# EAGLE design choochoo_v1_brd1 (EAGLE 7.7.0)
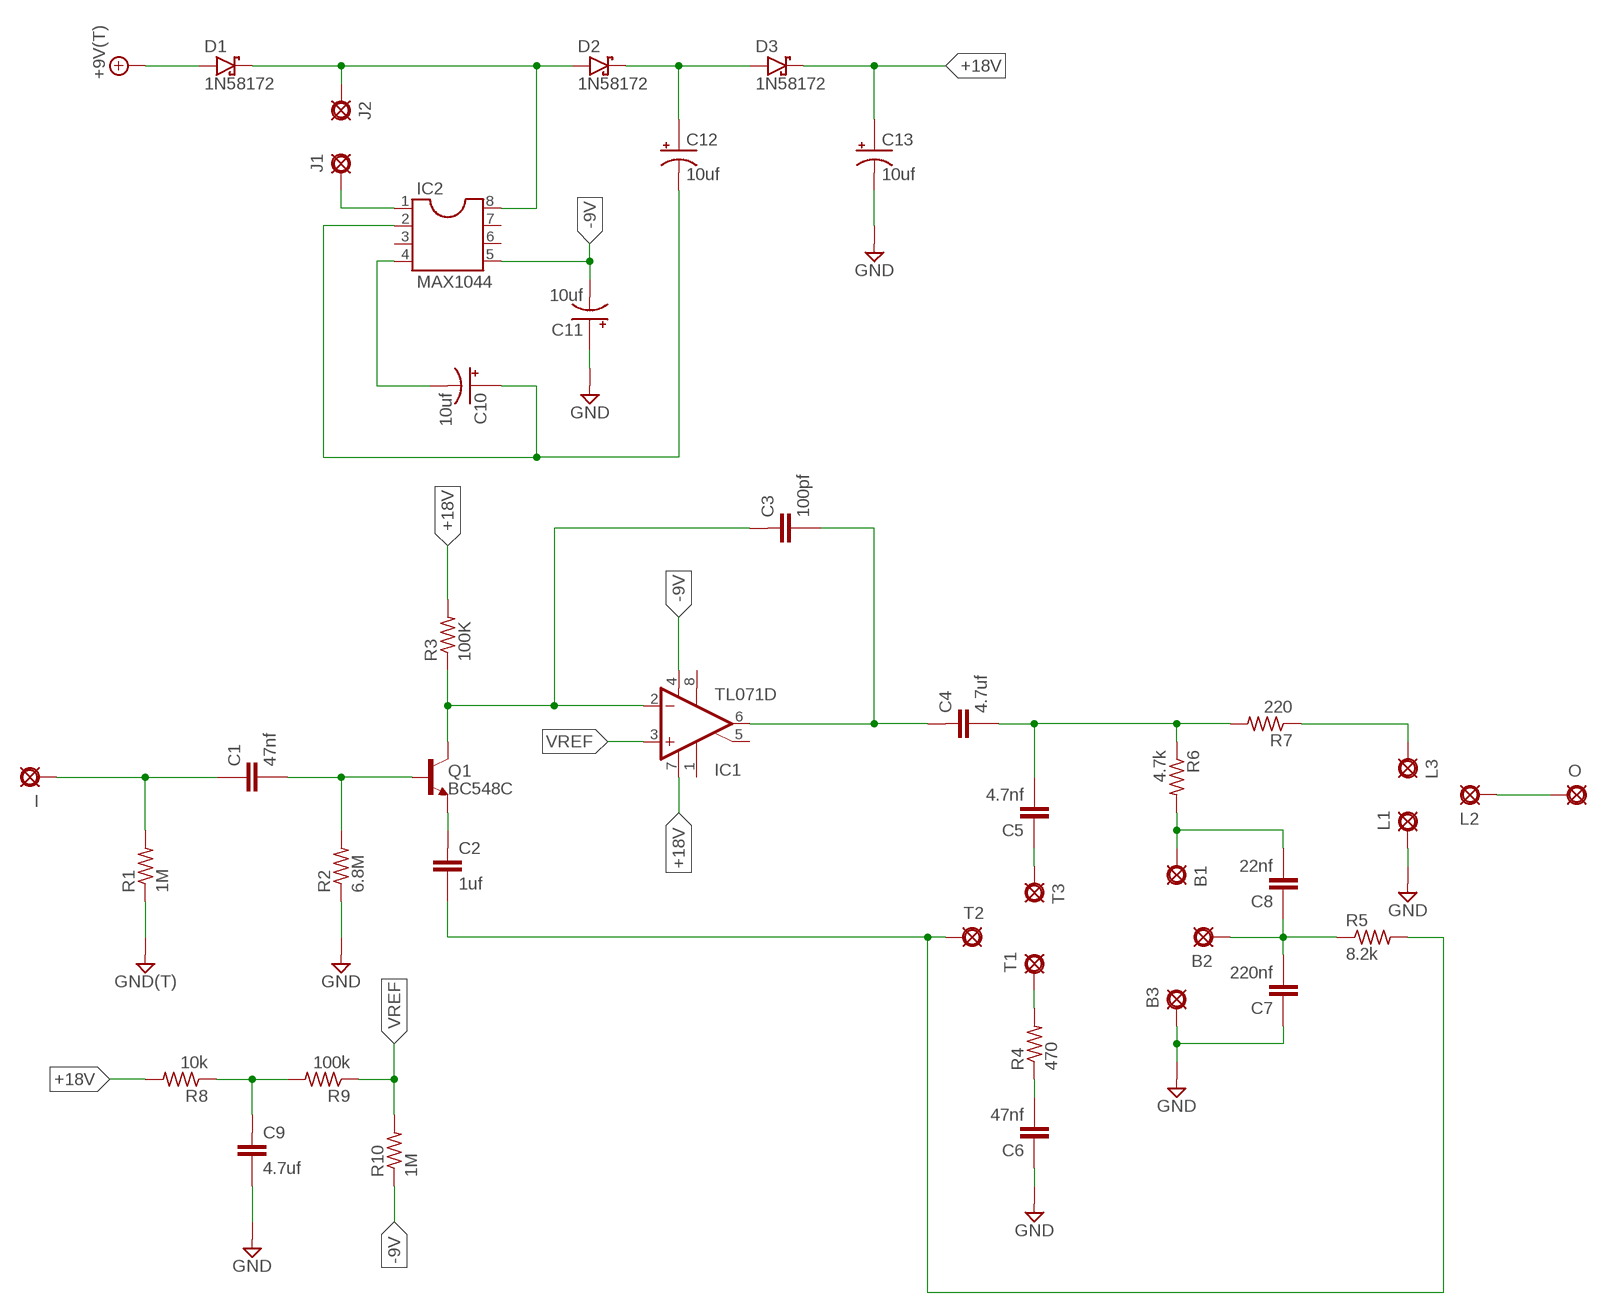
[diagram p0: schematic, sheet 1]

## Parts
B1  PAD8  [OCTOGON]
B2  PAD8  [OCTOGON]
B3  PAD8  [OCTOGON]
C1  47nf  072X0252  [072X025]
C2  1uf  050X030_0251  [050X030_025]
C3  100pf  050X030_0251  [050X030_025]
C4  4.7uf  050X030_0251  [050X030_025]
C5  4.7nf  072X0252  [072X025]
C6  47nf  072X0252  [072X025]
C7  220nf  072X0252  [072X025]
C8  22nf  072X0252  [072X025]
C9  4.7uf  050X030_0251  [050X030_025]
C10  10uf  0501  [050_020_1]
C11  10uf  0501  [050_020_1]
C12  10uf  0501  [050_020_1]
C13  10uf  0501  [050_020_1]
D1  1N58172  [DO41-2]
D2  1N58172  [DO41-2]
D3  1N58172  [DO41-2]
G  GND(T)  [SQUARE]
I  IN  PADO  [ROUND]
IC1  TL071D  [SO08]
IC2  MAX1044  [DIL08]
J1  PAD8  [OCTOGON]
J2  PAD8  [OCTOGON]
L1  PAD8  [OCTOGON]
L2  PAD8  [OCTOGON]
L3  PAD8  [OCTOGON]
O  IN  PADO  [ROUND]
Q1  BC548C  BC182L  [TO92-]
R1  1M  3MM.2  [R0204/2]
R2  6.8M  3MM.2  [R0204/2]
R3  100K  3MM.2  [R0204/2]
R4  470  3MM.2  [R0204/2]
R5  8.2k  3MM.2  [R0204/2]
R6  4.7k  3MM.2  [R0204/2]
R7  220  3MM.2  [R0204/2]
R8  10k  3MM.2  [R0204/2]
R9  100k  3MM.2  [R0204/2]
R10  1M  3MM.2  [R0204/2]
T1  PAD8  [OCTOGON]
T2  PAD8  [OCTOGON]
T3  PAD8  [OCTOGON]
V  +9V(T)  [SQUARE]

## Nets
+9V: D1.A V.1(+9V)
+18V: C13.+ D3.C IC1.7(V+) R3.2 R8.2
-9V: C11.- IC1.4(V-) IC2.5 R10.1
GND: B3.1(PAD) C6.1 C7.1 C9.2 C11.+ C13.- G.1(GND) L1.1(PAD) R1.1 R2.1
N$1: D1.C D2.A IC2.8 J2.1(PAD)
N$2: C1.2 Q1.1(B) R2.2
N$3: C3.1 IC1.2(-IN) Q1.2(C) R3.1
N$4: C2.1 Q1.3(E)
N$5: R4.2 T1.1(PAD)
N$6: C3.2 C4.1 IC1.6(OUT)
N$7: C5.1 T3.1(PAD)
N$8: C4.2 C5.2 R6.1 R7.2
N$9: L3.1(PAD) R7.1
N$10: C6.2 R4.1
N$11: C12.+ D2.C D3.A
N$12: L2.1(PAD) O.1(PAD)
N$13: B1.1(PAD) C8.2 R6.2
N$14: B2.1(PAD) C7.2 C8.1 R5.1
N$15: C9.1 R8.1 R9.2
N$16: C2.2 R5.2 T2.1(PAD)
N$17: C10.+ C12.- IC2.2
N$18: C10.- IC2.4
N$19: IC2.1 J1.1(PAD)
N$20: C1.1 I.1(PAD) R1.2
VREF: IC1.3(+IN) R9.1 R10.2
Unconnected: IC1.1(ON1) IC1.5(ON2) IC1.8(OPT) IC2.3 IC2.6 IC2.7

## Library data of the parts
B1-B3 I J1 J2 L1-L3 O T1-T3 = kdd-supply:PAD: PAD use this package for pads with any purpose, including input, output, send or return various pad shapes: round, square, octogonal, long, and long offset
C1 C5-C8 = kdd-caps-film-box:072X025: 1000pF - 0.47uF WIMA MKP2 63, 100V: 1000pF - 0.015uF; MKS2 50V: 0.33 - 0.47uF; 63V: 1000pF - 0.22uF;
C2-C4 C9 = kdd-caps-ceramic:050X030_025: 47 - 120pF Xicon Ceramic Disc 2.5mm lead spacing
C10-C13 = kdd-caps-electro-pol:050: 0.22 - 100uF Xicon values at Mouser.com: 10V: 10 - 100uF; 16V: 2.2 - 47uF; 25V: 0.47 - 47uF; 50V: 0.22 - 22uF
D1-D3 = kdd-diodes:1N5817
G = kdd-supply:GND(T): Ground use this to hook up ground (GND) throughout a schematic instead of running wire automatically labels the net "GND" adds a hookup pad to the circuit board (you can use several)
IC1 = kdd-ics:TL071: OP AMP
IC2 = kdd-ics:MAX1044
Q1 = kdd-trans:BC182L: NPN Transistor
R1-R10 = kdd-resistors:3MM: 3mm Resistors Leads spaced 1-6 holes apart for 0.1" perfboard. Suitable for 1/8 watt resistors.
V = kdd-supply:+9V(T): +9V Voltage Supply use this to hook up +9v throughout a schematic instead of running wire automatically labels the net "+9v" adds a hookup pad to the circuit board

## Board
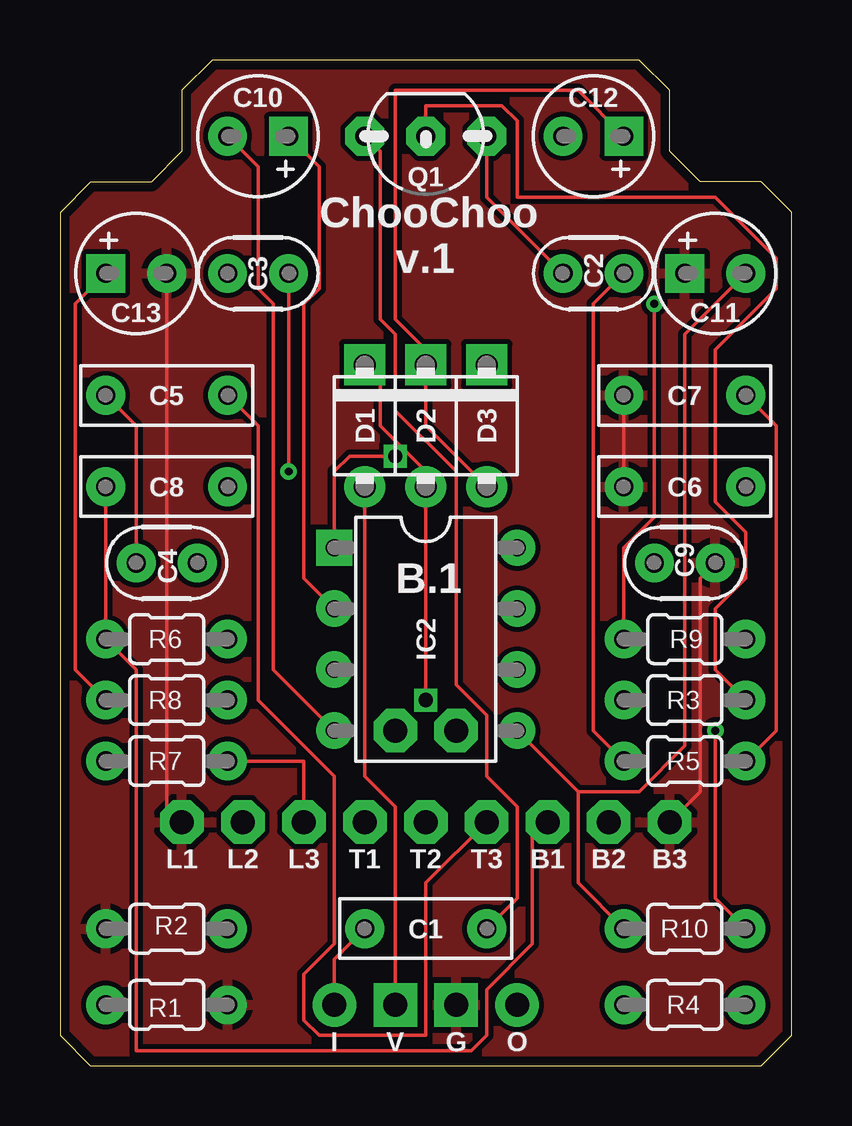
[diagram p1: board, top side]
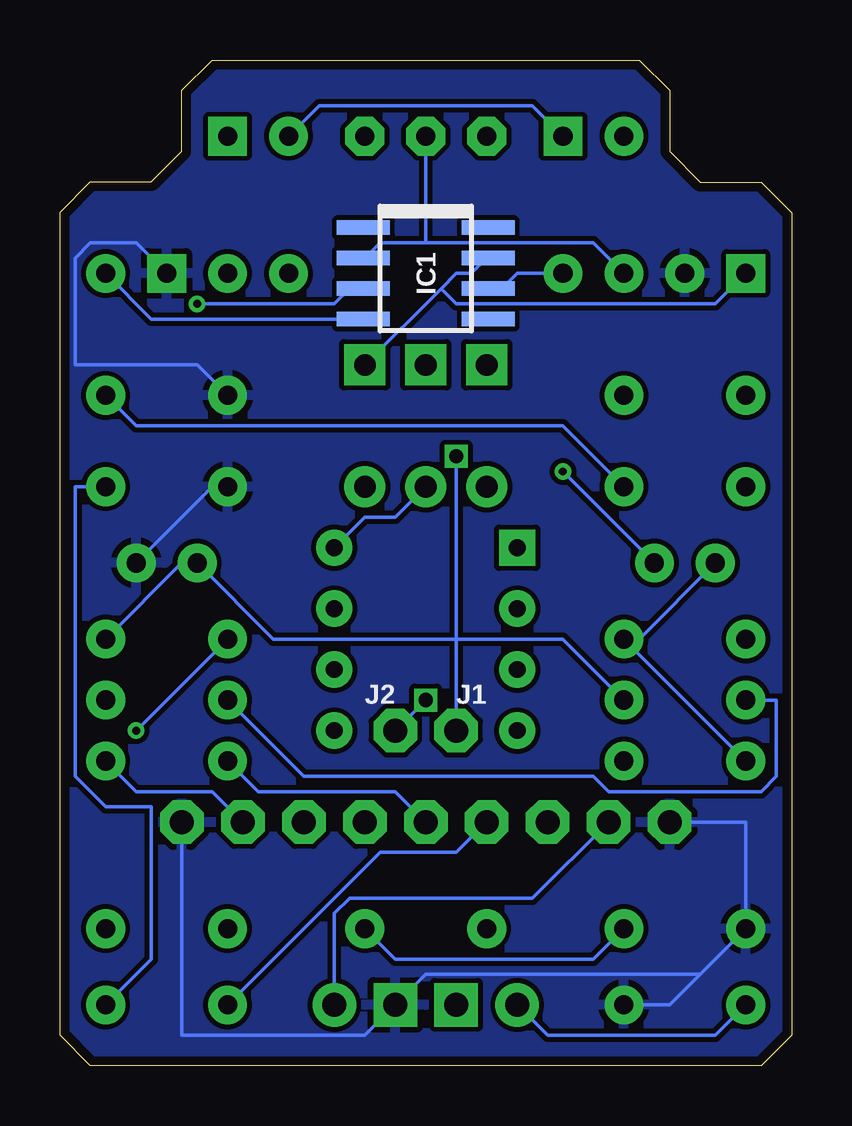
[diagram p2: board, bottom side, seen from below]

Size 30.48 x 41.91 mm. Coordinates in mm from the lower left corner, seen from the top.
Outline: 0,35.55 0,1.27 1.27,0 29.21,0 30.48,1.27 30.48,35.56 29.21,36.83 26.67,36.83 25.4,38.1 25.4,40.64 24.13,41.91 6.35,41.91 5.08,40.64 5.08,38.1 3.8,36.82 1.27,36.82 0,35.55
Copper layers (1*16): Top 0.0356mm / dielectric 1.5011mm / Bottom 0.0356mm
Design rules "Kyle-OSH": minimum track width 6mil, minimum drill 13mil, track to track 8mil, track to pad 8mil, pad to pad 8mil, via to via 8mil, smd to smd 6mil, copper to edge 15mil, drill to drill 6mil, minimum pad ring 16mil, minimum via ring 7mil, stop-mask expansion 3mil, vias tented up to drill 25mil, thermal gap 10mil

### Footprints (pad centres in the part's own frame; a part is rotated, then mirrored left to right if it is on the bottom)
OCTOGON = drill 1 octagon: 1 0,0
072X025 = drill 0.8: 1 -2.54,0; 2 2.54,0
050X030_025 = drill 0.8: 1 -1.27,0; 2 1.27,0
050_020_1 = drill 0.8 square: + -1.27,0 | drill 0.8: - 1.27,0
DO41-2 = drill 0.9: A 2.54,0 | drill 0.9 square: C -2.54,0
SQUARE = drill 1 square: 1 0,0
ROUND = drill 1: 1 0,0
SO08 = smd 0.6 x 2.2: 1 -1.905,-2.6; 2 -0.635,-2.6; 3 0.635,-2.6; 4 1.905,-2.6; 5 1.905,2.6; 6 0.635,2.6; 7 -0.635,2.6; 8 -1.905,2.6
DIL08 = drill 0.7 square: 1 -3.81,-3.81 | drill 0.7: 2 -1.27,-3.81; 3 1.27,-3.81; 4 3.81,-3.81; 5 3.81,3.81; 6 1.27,3.81; 7 -1.27,3.81; 8 -3.81,3.81
TO92- = drill 0.8 octagon: 1 2.54,0; 2 0,0; 3 -2.54,0
R0204/2 = drill 0.8: 1 -2.54,0; 2 2.54,0

### Placement (x,y rotation side)
B1  20.32,10.16 0 top
B2  22.86,10.16 0 top
B3  25.4,10.16 0 top
C1  15.24,5.71 0 top
C2  22.23,33.02 0 top
C3  8.26,33.02 0 top
C4  4.45,20.95 180 top
C5  4.45,27.94 180 top
C6  26.04,24.13 0 top
C7  26.04,27.94 0 top
C8  4.45,24.13 180 top
C9  26.04,20.95 0 top
C10  8.26,38.74 180 top
C11  27.3,33.02 0 top
C12  22.23,38.74 180 top
C13  3.17,33.02 0 top
D1  12.7,26.67 270 top
D2  15.24,26.67 270 top
D3  17.78,26.67 270 top
G  16.51,2.54 0 top
I  11.43,2.54 0 top
IC1  15.24,33.02 270 bottom
IC2  15.24,17.78 270 top
J1  13.97,13.97 180 bottom
J2  16.51,13.97 180 bottom
L1  5.08,10.16 0 top
L2  7.62,10.16 0 top
L3  10.16,10.16 0 top
O  19.05,2.54 0 top
Q1  15.24,38.74 180 top
R1  4.45,2.54 180 top
R2  4.45,5.71 0 top
R3  26.04,15.24 180 top
R4  26.04,2.54 180 top
R5  26.04,12.7 180 top
R6  4.45,17.78 180 top
R7  4.45,12.7 180 top
R8  4.45,15.24 180 top
R9  26.04,17.78 0 top
R10  26.04,5.71 0 top
T1  12.7,10.16 0 top
T2  15.24,10.16 0 top
T3  17.78,10.16 0 top
V  13.97,2.54 0 top

### Tracks (layer width: path | path; a pad name or v marks a point on that pad's centre or on a via)
+9V
  Top 0.152: D1.A 12.7,12.06 13.97,10.79 V.1
+18V
  Top 0.152: R8.2 0.64,16.51 0.64,31.75 C13.+
  Bottom 0.152: D3.C 14.61,32.38 | 14.61,32.38 13.97,33.02 13.34,33.02 12.7,33.66 IC1.7 | R3.2 20.32,12.06 8.26,12.06 7.62,11.43 1.27,11.43 0.64,12.06 0.64,15.24 R8.2 | 14.61,32.38 13.97,31.75 3.17,31.75 C13.+
-9V
  Top 0.152: 21.59,11.43 IC2.5 | 21.59,11.43 21.59,7.62 R10.1 | C11.- 26.04,30.48 26.04,13.33 24.13,11.43 21.59,11.43
  Bottom 0.152: IC1.4 26.67,31.11 C11.-
GND
  Top 0.152: C7.1 C6.1 | B3.1 26.67,11.43 26.67,20.32 C9.2 | C13.- 4.45,10.79 L1.1
  Bottom 0.152: C9.2 24.13,24.13 C6.1 | C11.+ 27.3,34.29 29.21,34.29 29.84,33.66 29.84,29.21 24.77,29.21 C7.1 | 3.81,3.81 5.08,2.54 R1.1 | 3.81,3.81 R2.1 1.91,10.16 L1.1 | 3.81,3.81 15.24,3.81 G.1 17.78,1.27 25.4,1.27 B3.1
  pour Top: -2.54,41.91 31.75,41.91 31.75,-1.27 -2.54,-1.27
  pour Bottom: -3.81,43.18 33.02,43.18 33.02,-2.54 -3.81,-2.54
N$1  (via drill 0.6)
  Top 0.152: D1.C 13.34,28.57 13.34,26.67 15.24,24.77 D2.A v15.24,15.24
  Bottom 0.152: IC2.8 17.78,22.86 16.51,22.86 D2.A | v15.24,15.24 J2.1
N$2
  Top 0.152: Q1.1 13.34,38.1 13.34,31.11 13.97,30.48 13.97,27.3 16.51,24.77 16.51,15.88 17.78,14.61 17.78,12.06 19.05,10.79 19.05,6.98 C1.2
  Bottom 0.152: R2.2 8.26,4.45 16.51,4.45 C1.2
N$3
  Top 0.152: R3.1 27.3,16.51 27.3,19.05 28.57,20.32 28.57,22.22 27.3,23.5 27.3,29.84 29.84,32.38 29.84,33.66 27.3,36.2 19.05,36.2 19.05,39.37 18.41,40.01 15.24,40.01 Q1.2
  Bottom 0.152: 15.24,34.29 8.26,34.29 C3.1 | 15.24,34.29 17.14,34.29 17.78,33.66 IC1.2 | Q1.2 15.24,34.29
N$4
  Top 0.152: C2.1 17.78,36.2 Q1.3
N$5
  Bottom 0.152: R4.2 17.14,8.89 13.97,8.89 T1.1
N$6  (via drill 0.33)
  Top 0.152: C3.2 v9.53,24.77
  Bottom 0.152: C3.2 11.43,33.02 12.06,32.38 IC1.6 | v9.53,24.77 C4.1
N$7
  Top 0.152: C5.1 8.26,26.67 8.26,15.24 11.43,12.06 11.43,5.08 10.16,3.81 10.16,1.91 10.79,1.27 15.24,1.27 15.24,7.62 T3.1
N$8
  Top 0.152: C5.2 3.17,26.67 C4.2
  Bottom 0.152: R7.2 R6.1 6.35,17.78 C4.2
N$9
  Top 0.152: R7.1 10.16,12.7 L3.1
N$10
  Bottom 0.152: R4.1 26.67,4.45 26.67,10.79 28.57,10.79 29.84,12.06 29.84,24.13 C6.2
N$11
  Top 0.152: C12.+ 21.59,40.64 13.97,40.64 13.97,31.11 15.24,29.84 D2.C 15.24,26.67 D3.A
N$12
  Bottom 0.152: L2.1 10.79,6.98 18.41,6.98 19.05,6.35 O.1
N$13
  Top 0.152: C8.2 R6.2 3.17,16.51 3.17,0.64 17.14,0.64 17.78,1.27 17.78,3.17 19.68,5.08 19.68,9.53 B1.1
N$14
  Top 0.152: R5.1 29.84,13.97 29.84,26.67 C7.2
  Bottom 0.152: R5.1 27.3,11.43 24.13,11.43 B2.1 | C8.1 9.53,26.67 27.3,26.67 C7.2
N$15
  Bottom 0.152: R8.1 9.53,17.78 21.59,17.78 C9.1 25.4,20.95 R9.2
N$16
  Top 0.152: C2.2 22.23,31.75 22.23,13.97 R5.2
  Bottom 0.152: R5.2 22.23,11.43 16.51,11.43 T2.1
N$17
  Top 0.152: IC2.2 10.16,20.32 10.16,31.75 10.79,32.38 10.79,37.47 C10.+
  Bottom 0.152: C12.- 19.68,40.01 10.79,40.01 C10.+
N$18
  Top 0.152: IC2.4 8.89,16.51 8.89,31.75 8.26,32.38 8.26,37.47 C10.-
N$19  (via drill 0.6)
  Top 0.152: IC2.1 11.43,24.77 12.06,25.4 v13.97,25.4
  Bottom 0.152: J1.1 v13.97,25.4
N$20
  Top 0.152: C1.1 11.43,4.45 I.1
  Bottom 0.152: R1.2 3.17,1.27 10.16,1.27 I.1
VREF  (via drill 0.33)
  Top 0.152: v24.77,31.75 24.77,22.86 23.5,21.59 R9.1 | R10.2 27.3,6.98 v27.3,13.97
  Bottom 0.152: v24.77,31.75 19.05,31.75 18.41,32.38 IC1.3 | R9.1 v27.3,13.97

### Text on the board
tNames: ChooChoo | v.1 | B.1